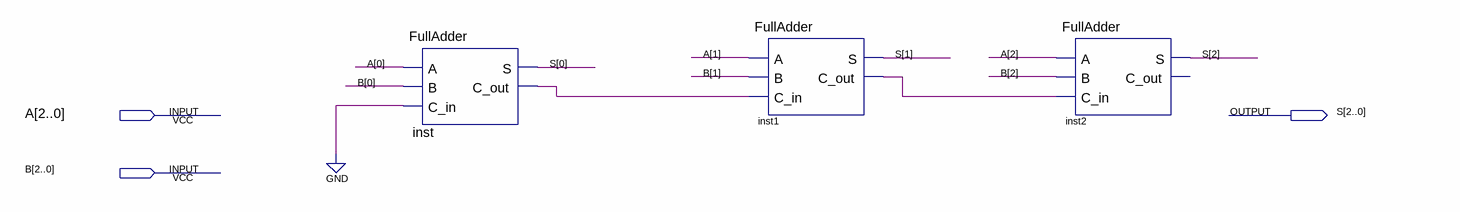
[diagram p0: schematic sheet]
// Quartus schematic Adder3bit.bdf as structural Verilog: 3 symbols, 3 pins
module Adder3bit (
  input  [2:0] A,
  input  [2:0] B,
  output [2:0] S
);

  wire inst1_c_out, inst_c_out;

  FullAdder inst (.A(A[0]), .B(B[0]), .C_in(1'b0), .S(S[0]), .C_out(inst_c_out));
  FullAdder inst1 (.A(A[1]), .B(B[1]), .C_in(inst_c_out), .S(S[1]), .C_out(inst1_c_out));
  FullAdder inst2 (.A(A[2]), .B(B[2]), .C_in(inst1_c_out), .S(S[2]));  // open: C_out
endmodule
